# Altium schematic sheet CCU-2-MCU.SchDoc
size A4; SheetNumber: 3; SheetTotal: 3
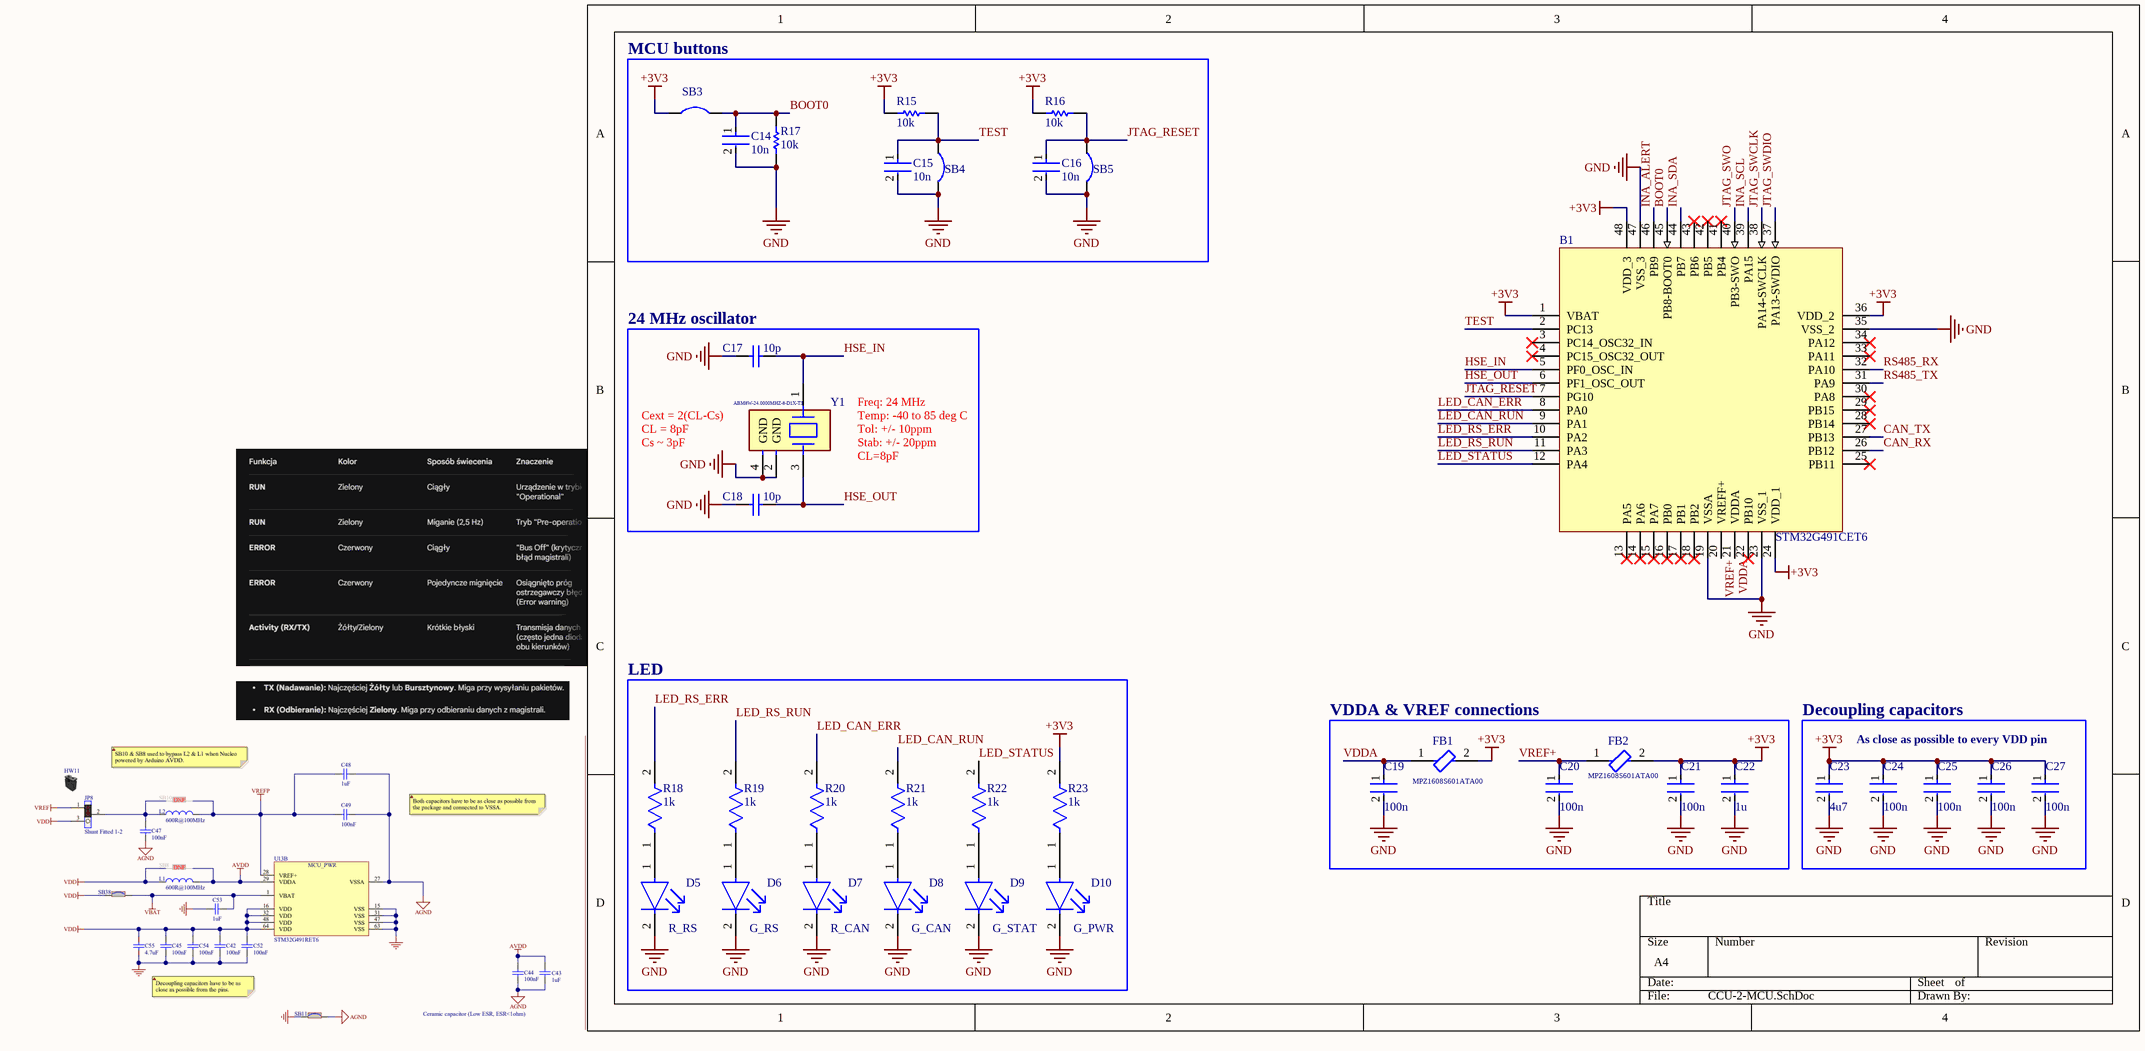
[diagram p0: CCU-2-MCU.SchDoc]

## Parts
B1  STM32G491CET6  [STM32G491CET6]
C14  10n  [FP-CC0603-DA-MFG]
C15  10n  [FP-CC0603-DA-MFG]
C16  10n  [FP-CC0603-DA-MFG]
C17  10p  [CAPC1608X90X35LL10T15]
C18  10p  [CAPC1608X90X35LL10T15]
C19  100n  [FP-C0603C-CF-MFG]
C20  100n  [FP-C0603C-CF-MFG]
C21  100n  [FP-C0603C-CF-MFG]
C22  1u  [FP-CC0805-0_85-MFG]
C23  4u7  [FP-GRM21B-0_15-IPC_C]
C24  100n  [FP-C0603C-CF-MFG]
C25  100n  [FP-C0603C-CF-MFG]
C26  100n  [FP-C0603C-CF-MFG]
C27  100n  [FP-C0603C-CF-MFG]
D5  R_RS  [FP-APT2012MGC-MFG]
D6  G_RS  [FP-APT2012MGC-MFG]
D7  R_CAN  [FP-APT2012MGC-MFG]
D8  G_CAN  [FP-APT2012MGC-MFG]
D9  G_STAT  [FP-APT2012MGC-MFG]
D10  G_PWR  [FP-APT2012MGC-MFG]
FB1  MPZ1608S601ATA00  [FP-MPZ1608-0_8-MFG]
FB2  MPZ1608S601ATA00  [FP-MPZ1608-0_8-MFG]
R15  10k  [RESC1608X55X25ML10T15]
R16  10k  [RESC1608X55X25ML10T15]
R17  10k  [RESC1608X55X25ML10T15]
R18  1k  [FP-RC0603-0_55-IPC_C]
R19  1k  [FP-RC0603-0_55-IPC_C]
R20  1k  [FP-RC0603-0_55-IPC_C]
R21  1k  [FP-RC0603-0_55-IPC_C]
R22  1k  [FP-RC0603-0_55-IPC_C]
R23  1k  [FP-RC0603-0_55-IPC_C]
SB3  Solder_Bridge  [Solder Bridge]  (value not drawn)
SB4  Solder_Bridge  [Solder Bridge]  (value not drawn)
SB5  Solder_Bridge  [Solder Bridge]  (value not drawn)
Y1  ABM8W-24.0000MHZ-8-D1X-T3  [FP-ABM8W-MFG]

## Blocks framed on the sheet
MCU buttons: C14-C16 R15-R17 SB3-SB5
24 MHz oscillator: C17 C18 Y1
LED: D5-D10 R18-R23
VDDA & VREF connections: C19-C22 FB1 FB2
Decoupling capacitors: C23-C27

## Nets
+3V3: B1.1(VBAT) B1.24(VDD_1) B1.36(VDD_2) B1.48(VDD_3) C21.1 C22.1 C23.1 C24.1 C25.1 C26.1 C27.1 FB1.2 FB2.2 R15.2 R16.2 R23.2 SB3.1
GND: B1.19(VSSA) B1.23(VSS_1) B1.35(VSS_2) B1.47(VSS_3) C14.2 C15.2 C16.2 C17.1 C18.1 C19.2 C20.2 C21.2 C22.2 C23.2 C24.2 C25.2 C26.2 C27.2 D5.2(C) D6.2(C) D7.2(C) D8.2(C) D9.2(C) D10.2(C) R17.1 SB4.2 SB5.2 Y1.2(GND) Y1.4(GND)
BOOT0: B1.45(PB8-BOOT0) C14.1 R17.2 SB3.2
CAN_RX: B1.26(PB12)
CAN_TX: B1.27(PB13)
HSE_IN: B1.5(PF0_OSC_IN) C17.2 Y1.1
HSE_OUT: B1.6(PF1_OSC_OUT) C18.2 Y1.3
INA_ALERT: B1.46(PB9)
INA_SCL: B1.39(PA15)
INA_SDA: B1.44(PB7)
JTAG_RESET: B1.7(PG10) C16.1 R16.1 SB5.1
JTAG_SWCLK: B1.38(PA14-SWCLK)
JTAG_SWDIO: B1.37(PA13-SWDIO)
JTAG_SWO: B1.40(PB3-SWO)
LED_CAN_ERR: B1.8(PA0) R20.2
LED_CAN_RUN: B1.9(PA1) R21.2
LED_RS_ERR: B1.10(PA2) R18.2
LED_RS_RUN: B1.11(PA3) R19.2
LED_STATUS: B1.12(PA4) R22.2
RS485_RX: B1.32(PA10)
RS485_TX: B1.31(PA9)
TEST: B1.2(PC13) C15.1 R15.1 SB4.1
VDDA: B1.21(VDDA) C19.1 FB1.1
VREF+: B1.20(VREFF+) C20.1 FB2.1
NetD5_1: D5.1(A) R18.1
NetD6_1: D6.1(A) R19.1
NetD7_1: D7.1(A) R20.1
NetD8_1: D8.1(A) R21.1
NetD9_1: D9.1(A) R22.1
NetD10_1: D10.1(A) R23.1

Not connected (* = marked no-connect by the designer): B1 3(PC14_OSC32_IN)* 4(PC15_OSC32_OUT)* 13(PA5)* 14(PA6)* 15(PA7)* 16(PB0)* 17(PB1)* 18(PB2)* 22(PB10)* 25(PB11)* 28(PB14)* 29(PB15)* 30(PA8)* 33(PA11)* 34(PA12)* 41(PB4)* 42(PB5)* 43(PB6)*

## Notes on the sheet
- (near Y1) Cext = 2(CL-Cs)
- CL = 8pF
- Cs ~ 3pF
- Temp: -40 to 85 deg C
- Tol: +/- 10ppm
- Stab: +/- 20ppm
- Freq: 24 MHz
- CL=8pF
- As close as possible to every VDD pin

## Library data of the parts
B1 = STM32G491CET6: ARM Microcontrollers - MCU Mainstream Arm Cortex-M4+ MCU 170MHz with 512Kbytes of Flash memory; Supplier 1: DigiKey; Supplier Part Number 1: 497-STM32G491CET6-ND
C14-C16 = CMP-2100-03600-2: CAP CER 10000PF 50V X7R 0603; Manufacturer Part Number: CC0603KRX7R9BB103; Manufacturer: YAGEO; Tolerance: 0.1; Material: Ceramic; Temperature Coefficient: 15%; Value: 10 nF; Mouser Description: Multilayer Ceramic Capacitor, CC Series, 0.01 - F, - 10%, X7R, 50 V, 0603 [1608 Metric]; Digikey Description: CAP CER 10000PF 50V X7R 0603; Height: 0.9mm; Category: Cap; Temperature Characteristic: X7R; Footprint Url: http://www.yageo.com/exep/pages/download/literatures/UPY-C_GEN_24.pdf; Lead Free: Yes; Voltage Rating: 50 V; Temperature: -55°C to +125°C; Device Class L3: Ceramic Capacitors; ComponentLink2Description: Datasheet; Voltage: 50 V; Package: CC0603-DA; Octopart: https://octopart.com/cc0603krx7r9bb103-yageo-192938; Automotive: No; Temperature Range High: +125°C; Temperature Range Low: -55°C; RoHS: TRUE; Device Class L1: Passive Components; ComponentLink2URL: http://www.yageo.com/documents/recent/UPY-GPHC_X7R_6.3V-to-50V_18.pdf; Device Class L2: Capacitors; Capacitance: 10 nF
C17 C18 = CMP-2006-02592-1: Part Number: GRM1885C1H100JA01D; Manufacturer: Murata
C19-C21 C24-C27 = CMP-2006-03057-2: CAP CER 0.1UF 25V X7R 0603; Manufacturer Part Number: C0603C104K3RACTU; Manufacturer: KEMET; Value: 0.10 μF; Material: Ceramic; Tolerance: 0.1; Temperature Coefficient: 30ppm/°C; Automotive Grade: Grade 1; Lead Free: Yes; Device Class L3: Ceramic Capacitors; Voltage Rating: 25 V; Digikey Description: CAP CER 0.1UF 25V X7R 0603; Mouser Description: Multilayer Ceramic Capacitors MLCC - SMD/SMT 25volts 0.1uF X7R 10%; Package: C0603C-CF; Temperature Range Low: -55°C; Automotive: Yes; Device Class L2: Capacitors; Octopart: https://octopart.com/c0603c104k3ractu-kemet-127541; ComponentLink2Description: Datasheet; ComponentLink2URL: https://api.kemet.com/component-edge/download/datasheet/C0603C100J5GACAUTO.pdf; Temperature Range High: +125°C; RoHS: TRUE; Device Class L1: Passive Components; Category: Cap; Temperature: -55°C to +125°C; Capacitance: 0.10 μF; Height: 0.87mm; Temperature Characteristic: X7R
C22 = CMP-2100-03605-2: CAP CER 1UF 25V X7R 0805; Manufacturer Part Number: CC0805KKX7R8BB105; Manufacturer: Yageo; Material: Ceramic; Tolerance: 0.1; Capacitance: 1 uF; Temperature Characteristic: X7R; RoHS: TRUE; Value: 1 uF; Package: CC0805-0.85; Ipc Land Pattern Name: CAPC200125X85; Device Class L2: Capacitors; ComponentLink2URL: http://www.yageo.com/documents/recent/UPY-GPHC_Y5V_6.3V-to-50V_8.pdf; Height: 0.95mm; ComponentLink2Description: Datasheet; Voltage Rating: 25 V; Automotive: No; Device Class L1: Passive Components; Lead Free: Yes; Temperature Range Low: -30°C; Digikey Description: CAP CER 1UF 25V X7R 0805; Temperature: -30°C to +85°C; Temperature Range High: +85°C; Category: Cap; Device Class L3: Ceramic Capacitors; Footprint Url: http://www.yageo.com/exep/pages/download/literatures/UPY-C_GEN_24.pdf; Octopart: https://octopart.com/cc0805kkx7r8bb105-yageo-42244645; Mouser Description: Multilayer Ceramic Capacitor, CC Series, 1 - F, - 10%, X7R, 25 V, 0805 [2012 Metric]
C23 = CMP-06035-004324-1: Chip Multilayer Ceramic Capacitors for General Purpose, 0805, 4.7uF, X7R, 15%, 10%, 16V; Case/Package: 0805; Width: 1.25mm; Tolerance: 10%; Dielectric: X7R; Thickness: 1.25mm; Capacitance: 4.7uF; Voltage Rating (DC): 16V; Length: 2mm
D5-D10 = CMP-44529-000017-1: LED GREEN CLEAR CHIP SMD; Power Rating: 75mW; Lens Color: Colorless; Luminous Intensity: 70mcd; Forward Current: 20mA; Dominant Wavelength: 570nm; Viewing Angle: 120°; Forward Voltage: 2.1V; Package Quantity: 2000; Color: Green; Length: 2mm; Lead Free: Lead Free; Min Operating Temperature: -40°C; Illumination Color: Green; Case/Package: 0805; Width: 1.25mm; Test Current: 20mA; Max Operating Temperature: 85°C; Case Code (Imperial): 0805; Mount: Surface Mount; Lens Style: Clear; Height: 0.75mm; Case Code (Metric): 2012; Packaging: Tape and Reel; Lens Transparency: Clear
FB1 FB2 = CMP-08257-000179-1: Power line Ferrite Bead 600Ω @ 100MHz 1A DCR 0.15Ω SMD 0603; Impedance: 600R; DC Resistance (DCR): 150mR; Tolerance: 25%; Depth: 0.8mm; Packaging: Tape and Reel; Package Quantity: 4000; Height: 0.8mm; Length: 0.063inch; Series: MPZ; Weight: 7.1E-05oz; Width: 0.8mm; Mount: Surface Mount; Case Code (Imperial): 0603; Case/Package: 0603; Max Operating Temperature: 125°C; Max DC Current: 1A; Test Frequency: 100MHz; Min Operating Temperature: -55°C; Current Rating: 1A; Core Material: Ferrite; RoHS Compliant: Yes; REACH SVHC: No SVHC; Case Code (Metric): 1608; Termination: SMD/SMT; Lead Free: Lead Free
R15-R17 = CMP-2000-05022-1: Resistor, 10 KOhm, +/- 5%, 100 mW, -55 to 155 degC, 0603 (1608 Metric), RoHS, Tape and Reel; Manufacturer: Yageo; Resistance: 10kOhms; Voltage Rating: 50V; Temperature Coefficient: 100PPM/C; Power Rating: 100mW; Package Reference: 603; Series: RC; Case Code - mm: 1608; Packaging: Reel; Datasheet URL: http://www.farnell.com/datasheets/443971.pdf; Datasheet Version: Rev. 4, 04/2009; Operating Temperature Range: -55Cto+155C; Product: ThickFilmResistorsGeneralPurpose; Package Description: 2-Pin Surface Mount Device, Body 1.6 x 0.8 mm; Manufacturer URL: http://www.yageo.com/; Case Code - in: 0603; Tolerance: 5%; Termination Style: SMD/SMT
R18-R23 = CMP-1659-00009-5: RES 1K OHM 1% 1/10W 0603; Resistance: 1kR; Voltage Rating: 50V; Power Rating: 100mW; Temperature Coefficient: 100ppm/°C; Military Standard: Not; REACH SVHC: No SVHC; Size Code: 0603; Features: Moisture Resistant; Number of Terminations: 2; Technology: THICK FILM; Series: RC; Case Code (Metric): 1608; Resistance Tolerance: 1%; Resistor Type: Thick Film; Termination: SMD/SMT; Contact Plating: Tin; Radiation Hardening: No; Min Operating Temperature: -55°C; Max Operating Temperature: 155°C; Packaging: Tape and Reel; Max Power Dissipation: 100mW; RoHS Compliant: Yes; Height: 0.45mm; Lead Free: Lead Free; Case/Package: 0603; Length: 1.6mm; Tolerance: 1%; Case Code (Imperial): 0603; Construction: Rectangular; Depth: 0.8mm
SB3-SB5 = Solder_Bridge: Bridge 0.5mm gap, 2mm width
Y1 = CMP-27762-013973-3: Crystal 24MHz ±10ppm (Tol) ±20ppm (Stability) 8pF FUND 50Ω 4-Pin SMD T/R